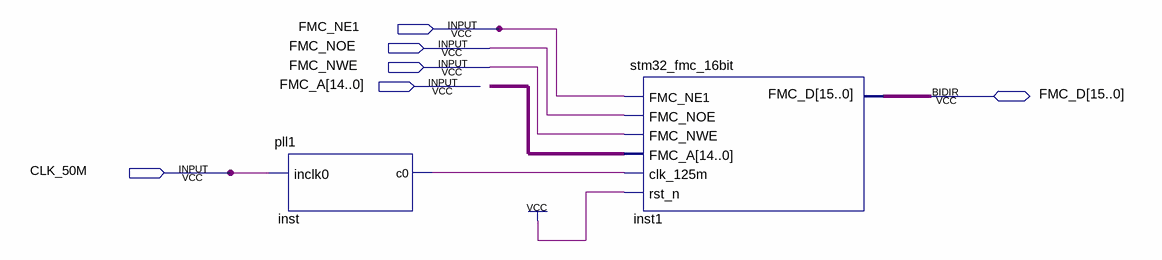
[diagram p0: schematic sheet]
// Quartus schematic FMC_Demo.bdf as structural Verilog: 2 symbols, 6 pins
module FMC_Demo (
  input  FMC_NE1,
  input  FMC_NOE,
  input  FMC_NWE,
  input  [14:0] FMC_A,
  input  CLK_50M,
  inout  [15:0] FMC_D
);

  wire inst_c0;
  wire [14:0] undriven;

  pll1 inst (.inclk0(CLK_50M), .c0(inst_c0));
  stm32_fmc_16bit inst1 (
    .FMC_NE1(FMC_NE1), .FMC_NOE(FMC_NOE), .FMC_NWE(FMC_NWE), .FMC_A(undriven), .clk_125m(inst_c0),
    .rst_n(1'b1), .FMC_D(FMC_D));
endmodule
